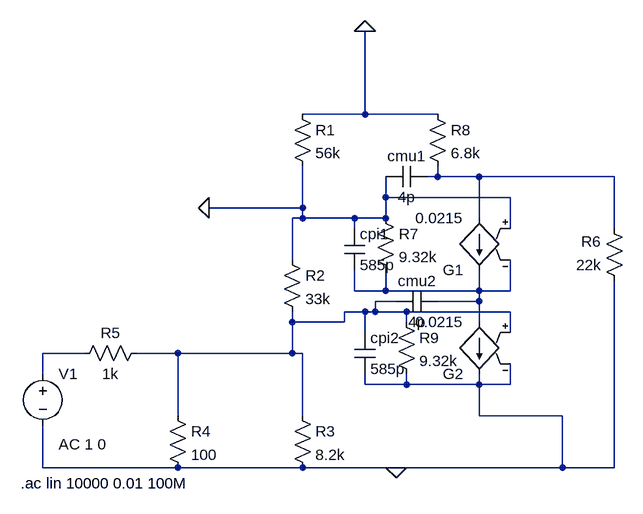
[diagram p0: schematic Draft2.asc]
Draft2.asc, the LTspice schematic file:
Version 4
SHEET 1 880 680
WIRE 96 -64 96 -192
WIRE 96 -64 0 -64
WIRE 208 -64 96 -64
WIRE 208 32 208 16
WIRE 208 32 192 32
WIRE 272 32 208 32
WIRE 480 32 272 32
WIRE 128 64 128 32
WIRE 320 64 128 64
WIRE 0 80 0 16
WIRE 0 80 -144 80
WIRE 0 96 0 80
WIRE 0 96 -16 96
WIRE 80 96 0 96
WIRE 128 96 128 64
WIRE 128 96 80 96
WIRE 272 96 272 32
WIRE 80 112 80 96
WIRE 320 112 320 64
WIRE 480 112 480 32
WIRE -16 160 -16 96
WIRE 80 208 80 176
WIRE 128 208 128 176
WIRE 128 208 80 208
WIRE 272 208 272 176
WIRE 272 208 128 208
WIRE 320 208 320 160
WIRE 320 208 272 208
WIRE 144 224 112 224
WIRE 272 224 272 208
WIRE 272 224 208 224
WIRE 96 240 64 240
WIRE 112 240 112 224
WIRE 112 240 96 240
WIRE 160 240 112 240
WIRE 320 240 160 240
WIRE -16 256 -16 240
WIRE 64 256 64 240
WIRE 64 256 -16 256
WIRE 160 256 160 240
WIRE 272 256 272 224
WIRE 96 272 96 240
WIRE 320 272 320 240
WIRE -336 304 -400 304
WIRE -192 304 -256 304
WIRE -16 304 -16 256
WIRE -16 304 -192 304
WIRE 0 304 -16 304
WIRE -400 336 -400 304
WIRE 96 352 96 336
WIRE 160 352 160 336
WIRE 160 352 96 352
WIRE 272 352 272 336
WIRE 272 352 160 352
WIRE 320 352 320 320
WIRE 320 352 272 352
WIRE -192 400 -192 304
WIRE 0 400 0 304
WIRE 272 400 272 352
WIRE 400 400 272 400
WIRE -400 480 -400 416
WIRE -192 480 -400 480
WIRE 0 480 -192 480
WIRE 144 480 0 480
WIRE 400 480 400 400
WIRE 400 480 144 480
WIRE 480 480 480 192
WIRE 480 480 400 480
FLAG -144 80 0
FLAG 144 480 0
FLAG 96 -192 0
SYMBOL res -16 -80 R0
SYMATTR InstName R1
SYMATTR Value 56k
SYMBOL res -32 144 R0
SYMATTR InstName R2
SYMATTR Value 33k
SYMBOL res -16 384 R0
SYMATTR InstName R3
SYMATTR Value 8.2k
SYMBOL res -208 384 R0
SYMATTR InstName R4
SYMATTR Value 100
SYMBOL res -240 288 R90
WINDOW 0 0 56 VBottom 2
WINDOW 3 32 56 VTop 2
SYMATTR InstName R5
SYMATTR Value 1k
SYMBOL res 496 208 R180
WINDOW 0 36 76 Left 2
WINDOW 3 36 40 Left 2
SYMATTR InstName R6
SYMATTR Value 22k
SYMBOL voltage -400 320 R0
WINDOW 123 24 124 Left 2
WINDOW 39 0 0 Left 0
SYMATTR InstName V1
SYMATTR Value ""
SYMATTR Value2 AC 1 0
SYMBOL res 192 -80 R0
SYMATTR InstName R8
SYMATTR Value 6.8k
SYMBOL res 112 80 R0
SYMATTR InstName R7
SYMATTR Value 9.32k
SYMBOL g2 272 192 R180
SYMATTR InstName G1
SYMATTR Value 0.0215
SYMBOL g2 272 352 R180
SYMATTR InstName G2
SYMATTR Value 0.0215
SYMBOL res 144 240 R0
SYMATTR InstName R9
SYMATTR Value 9.32k
SYMBOL cap 64 112 R0
SYMATTR InstName cpi1
SYMATTR Value 585p
SYMBOL cap 80 272 R0
SYMATTR InstName cpi2
SYMATTR Value 585p
SYMBOL cap 192 16 R90
WINDOW 0 0 32 VBottom 2
WINDOW 3 32 32 VTop 2
SYMATTR InstName cmu1
SYMATTR Value 4p
SYMBOL cap 144 240 R270
WINDOW 0 32 32 VTop 2
WINDOW 3 0 32 VBottom 2
SYMATTR InstName cmu2
SYMATTR Value 4p
TEXT -434 504 Left 2 !.ac lin 10000 0.01 100M

The netlist it stands for:
* Draft2.asc
R1 0 0 56k
R2 0 N003 33k
R3 N003 0 8.2k
R4 N003 0 100
R5 N003 N004 1k
R6 0 N001 22k
V1 N004 0 AC 1 0
R8 0 N001 6.8k
R7 0 N002 9.32k
G1 N001 N002 0 N002 0.0215
G2 N002 0 N003 0 0.0215
R9 N003 0 9.32k
cpi1 0 N002 585p
cpi2 N003 0 585p
cmu1 N001 0 4p
cmu2 N003 N002 4p
.ac lin 10000 0.01 100M
.backanno
.end